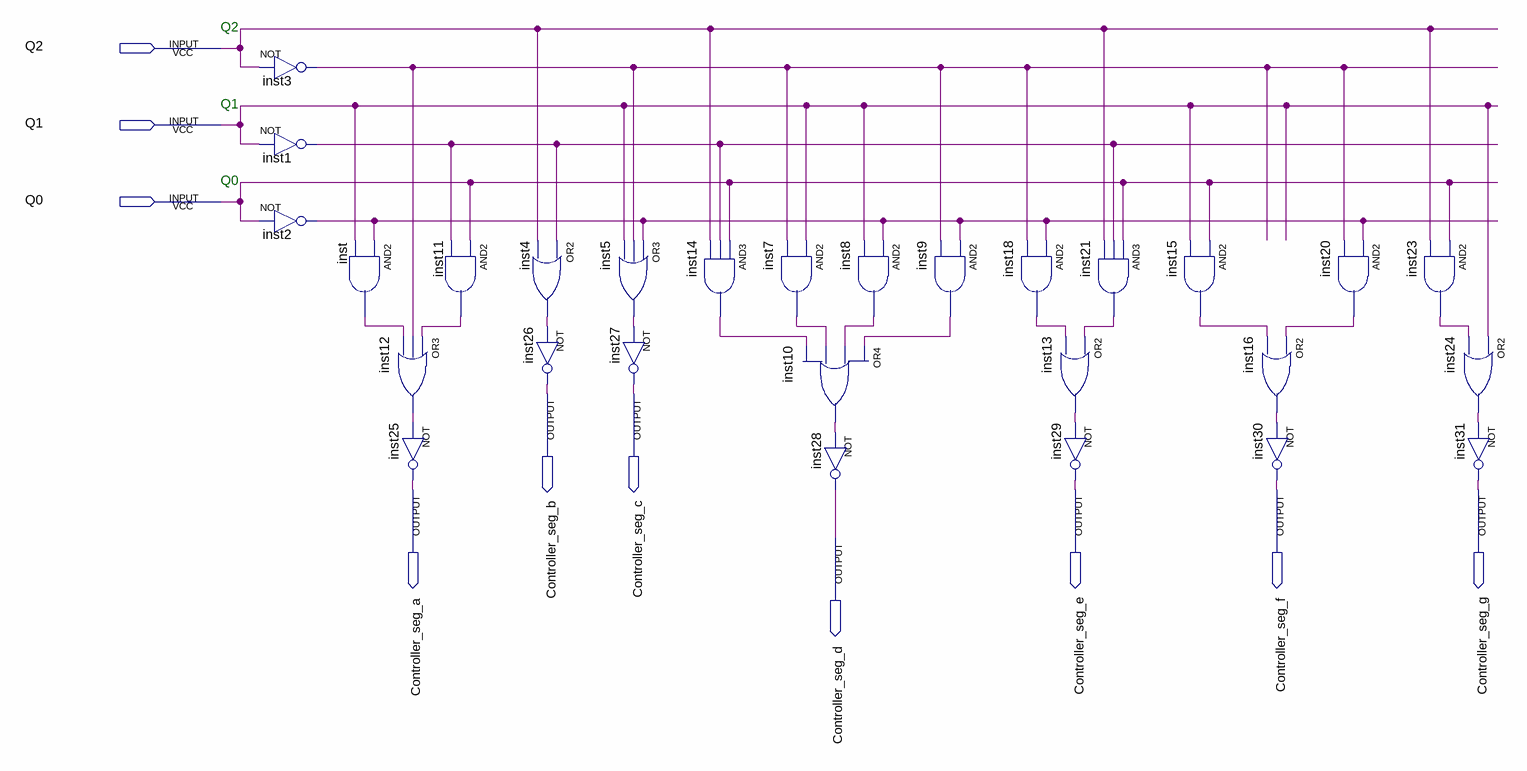
[diagram p0: schematic sheet]
// Quartus schematic Controller_7-seg.bdf as structural Verilog: 28 symbols, 10 pins
module \Controller_7-seg  (
  input  Q2,
  input  Q1,
  input  Q0,
  output Controller_seg_b,
  output Controller_seg_c,
  output Controller_seg_a,
  output Controller_seg_e,
  output Controller_seg_f,
  output Controller_seg_g,
  output Controller_seg_d
);

  wire inst1_out, inst2_out, inst3_out, inst4_out, inst5_out, inst7_out, inst8_out, inst9_out, inst10_out,
       inst11_out, inst12_out, inst13_out, inst14_out, inst15_out, inst16_out, inst18_out, inst20_out,
       inst21_out, inst23_out, inst24_out, inst_out;

  not inst3 (inst3_out, Q2);
  not inst1 (inst1_out, Q1);
  not inst2 (inst2_out, Q0);
  and inst (inst_out, inst2_out, Q1);
  or inst12 (inst12_out, inst11_out, inst3_out, inst_out);
  not inst25 (Controller_seg_a, inst12_out);
  and inst11 (inst11_out, Q0, inst1_out);
  or inst4 (inst4_out, inst1_out, Q2);
  not inst26 (Controller_seg_b, inst4_out);
  or inst5 (inst5_out, inst2_out, inst3_out, Q1);
  not inst27 (Controller_seg_c, inst5_out);
  and inst14 (inst14_out, Q0, inst1_out, Q2);
  and inst7 (inst7_out, Q1, inst3_out);
  or inst10 (inst10_out, inst9_out, inst8_out, inst7_out, inst14_out);
  and inst8 (inst8_out, inst2_out, Q1);
  not inst28 (Controller_seg_d, inst10_out);
  and inst9 (inst9_out, inst2_out, inst3_out);
  and inst18 (inst18_out, inst2_out, inst3_out);
  and inst21 (inst21_out, Q0, inst1_out, Q2);
  or inst13 (inst13_out, inst21_out, inst18_out);
  not inst29 (Controller_seg_e, inst13_out);
  and inst15 (inst15_out, Q0, Q1);
  or inst16 (inst16_out, inst20_out, inst15_out);
  and inst20 (inst20_out, inst2_out, inst3_out);
  not inst30 (Controller_seg_f, inst16_out);
  and inst23 (inst23_out, Q0, Q2);
  or inst24 (inst24_out, Q1, inst23_out);
  not inst31 (Controller_seg_g, inst24_out);

  // Notes on the sheet:
  //   Q2
  //   Q1
  //   Q0
endmodule
